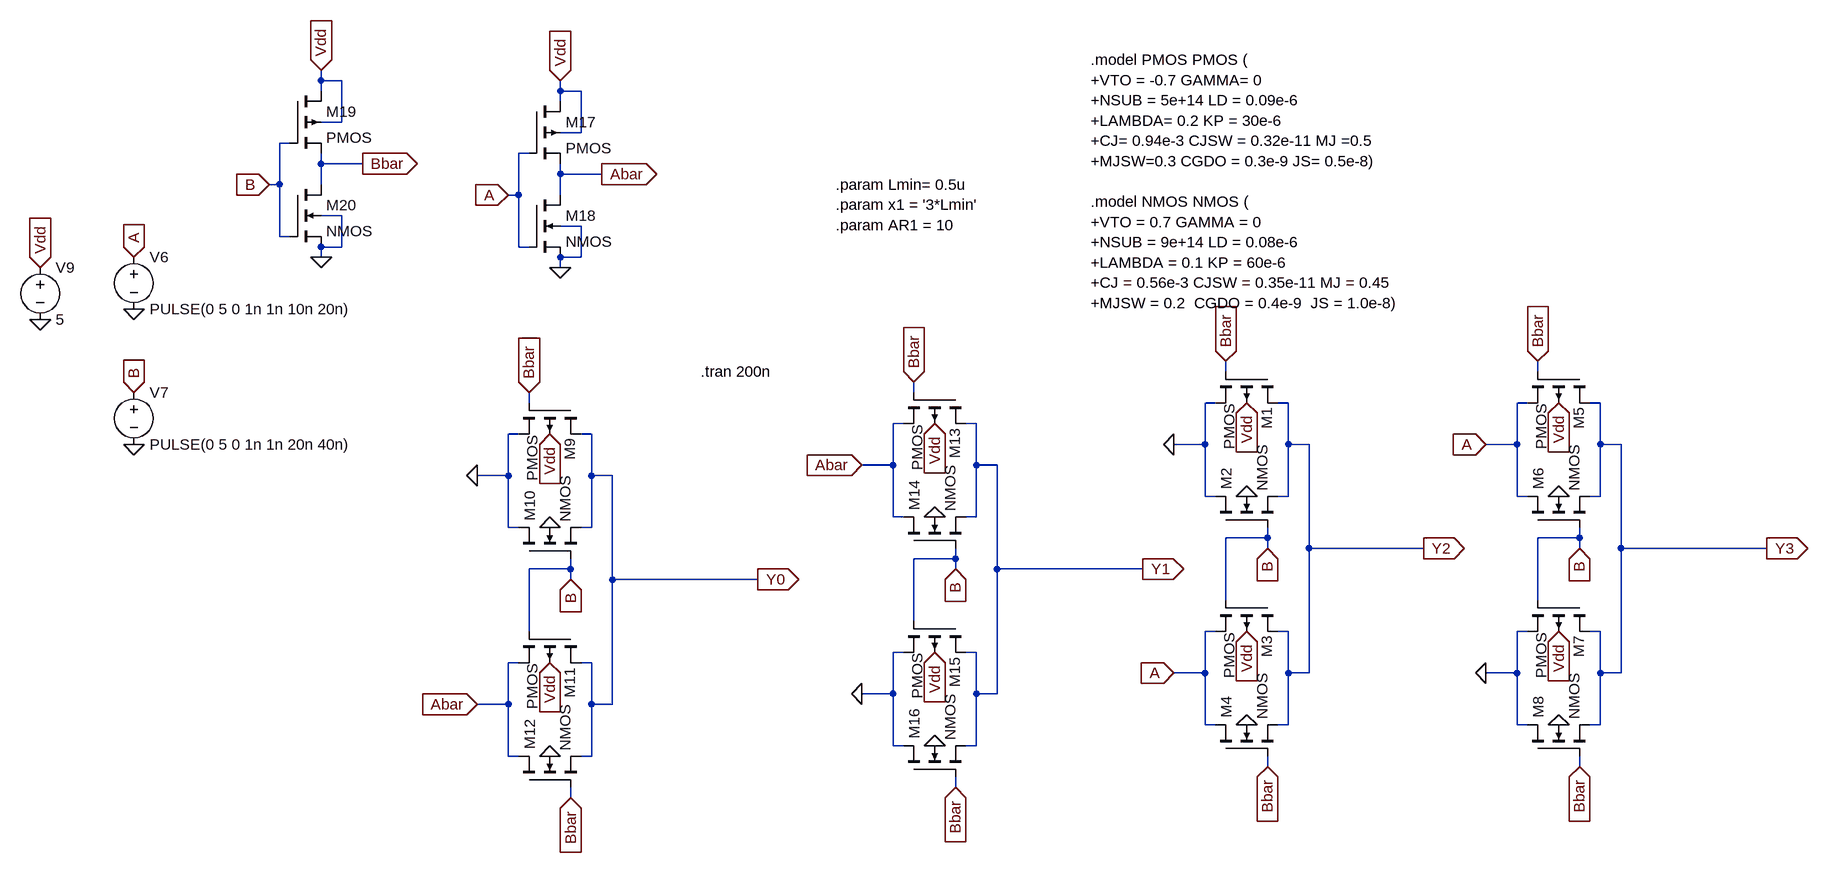
[diagram p0: schematic Txn gate 2x4 decoder.asc]
Txn gate 2x4 decoder.asc, the LTspice schematic file:
Version 4
SHEET 1 1412 1060
WIRE -1472 -160 -1472 -176
WIRE -1440 -160 -1472 -160
WIRE -1472 -144 -1472 -160
WIRE -1104 -144 -1104 -160
WIRE -1072 -144 -1104 -144
WIRE -1104 -128 -1104 -144
WIRE -1440 -96 -1440 -160
WIRE -1440 -96 -1472 -96
WIRE -1072 -80 -1072 -144
WIRE -1072 -80 -1104 -80
WIRE -1520 -64 -1536 -64
WIRE -1152 -48 -1168 -48
WIRE -1472 -32 -1472 -48
WIRE -1408 -32 -1472 -32
WIRE -1104 -16 -1104 -32
WIRE -1040 -16 -1104 -16
WIRE -1536 0 -1536 -64
WIRE -1536 0 -1552 0
WIRE -1472 0 -1472 -32
WIRE -1168 16 -1168 -48
WIRE -1168 16 -1184 16
WIRE -1104 16 -1104 -16
WIRE -1440 48 -1472 48
WIRE -1072 64 -1104 64
WIRE -1536 80 -1536 0
WIRE -1520 80 -1536 80
WIRE -1440 96 -1440 48
WIRE -1440 96 -1472 96
WIRE -1168 96 -1168 16
WIRE -1152 96 -1168 96
WIRE -1472 112 -1472 96
WIRE -1072 112 -1072 64
WIRE -1072 112 -1104 112
WIRE -1104 128 -1104 112
WIRE -80 288 -80 272
WIRE 400 288 400 272
WIRE -560 320 -560 304
WIRE -1152 336 -1152 320
WIRE -96 336 -112 336
WIRE 16 336 0 336
WIRE 384 336 368 336
WIRE 496 336 480 336
WIRE -576 368 -592 368
WIRE -464 368 -480 368
WIRE -1168 384 -1184 384
WIRE -1056 384 -1072 384
WIRE -112 400 -112 336
WIRE -112 400 -160 400
WIRE 16 400 16 336
WIRE 48 400 16 400
WIRE 368 400 368 336
WIRE 368 400 320 400
WIRE 496 400 496 336
WIRE 528 400 496 400
WIRE -592 432 -592 368
WIRE -592 432 -640 432
WIRE -464 432 -464 368
WIRE -432 432 -464 432
WIRE -1184 448 -1184 384
WIRE -1184 448 -1232 448
WIRE -1056 448 -1056 384
WIRE -1024 448 -1056 448
WIRE -112 480 -112 400
WIRE -96 480 -112 480
WIRE 16 480 16 400
WIRE 16 480 0 480
WIRE 368 480 368 400
WIRE 384 480 368 480
WIRE 496 480 496 400
WIRE 496 480 480 480
WIRE -592 512 -592 432
WIRE -576 512 -592 512
WIRE -464 512 -464 432
WIRE -464 512 -480 512
WIRE -1184 528 -1184 448
WIRE -1168 528 -1184 528
WIRE -1056 528 -1056 448
WIRE -1056 528 -1072 528
WIRE -16 544 -16 528
WIRE -16 544 -80 544
WIRE 464 544 464 528
WIRE 464 544 400 544
WIRE -16 560 -16 544
WIRE 48 560 48 400
WIRE 224 560 48 560
WIRE 464 560 464 544
WIRE 528 560 528 400
WIRE 752 560 528 560
WIRE -496 576 -496 560
WIRE -496 576 -560 576
WIRE -1088 592 -1088 576
WIRE -1088 592 -1152 592
WIRE -496 592 -496 576
WIRE -432 592 -432 432
WIRE -208 592 -432 592
WIRE -1088 608 -1088 592
WIRE -1024 608 -1024 448
WIRE -800 608 -1024 608
WIRE -80 640 -80 544
WIRE 400 640 400 544
WIRE -560 672 -560 576
WIRE -1152 688 -1152 592
WIRE -96 688 -112 688
WIRE 16 688 0 688
WIRE 384 688 368 688
WIRE 496 688 480 688
WIRE -576 720 -592 720
WIRE -464 720 -480 720
WIRE -1168 736 -1184 736
WIRE -1056 736 -1072 736
WIRE -112 752 -112 688
WIRE -112 752 -160 752
WIRE 16 752 16 688
WIRE 48 752 48 560
WIRE 48 752 16 752
WIRE 368 752 368 688
WIRE 368 752 320 752
WIRE 496 752 496 688
WIRE 528 752 528 560
WIRE 528 752 496 752
WIRE -592 784 -592 720
WIRE -592 784 -640 784
WIRE -464 784 -464 720
WIRE -432 784 -432 592
WIRE -432 784 -464 784
WIRE -1184 800 -1184 736
WIRE -1184 800 -1232 800
WIRE -1056 800 -1056 736
WIRE -1024 800 -1024 608
WIRE -1024 800 -1056 800
WIRE -112 832 -112 752
WIRE -96 832 -112 832
WIRE 16 832 16 752
WIRE 16 832 0 832
WIRE 368 832 368 752
WIRE 384 832 368 832
WIRE 496 832 496 752
WIRE 496 832 480 832
WIRE -592 864 -592 784
WIRE -576 864 -592 864
WIRE -464 864 -464 784
WIRE -464 864 -480 864
WIRE -1184 880 -1184 800
WIRE -1168 880 -1184 880
WIRE -1056 880 -1056 800
WIRE -1056 880 -1072 880
WIRE -16 896 -16 880
WIRE 464 896 464 880
WIRE -496 928 -496 912
WIRE -1088 944 -1088 928
FLAG -48 480 0
FLAG -48 336 Vdd
IOPIN -48 336 In
FLAG 224 560 Y2
IOPIN 224 560 Out
FLAG -16 560 B
IOPIN -16 560 In
FLAG -80 272 Bbar
IOPIN -80 272 In
FLAG -48 832 0
FLAG -48 688 Vdd
IOPIN -48 688 In
FLAG -16 896 Bbar
IOPIN -16 896 In
FLAG 432 480 0
FLAG 432 336 Vdd
IOPIN 432 336 In
FLAG 320 400 A
IOPIN 320 400 In
FLAG 752 560 Y3
IOPIN 752 560 Out
FLAG 464 560 B
IOPIN 464 560 In
FLAG 400 272 Bbar
IOPIN 400 272 In
FLAG 432 832 0
FLAG 432 688 Vdd
IOPIN 432 688 In
FLAG 464 896 Bbar
IOPIN 464 896 In
FLAG 320 752 0
FLAG -1120 528 0
FLAG -1120 384 Vdd
IOPIN -1120 384 In
FLAG -800 608 Y0
IOPIN -800 608 Out
FLAG -1088 608 B
IOPIN -1088 608 In
FLAG -1152 320 Bbar
IOPIN -1152 320 In
FLAG -1120 880 0
FLAG -1120 736 Vdd
IOPIN -1120 736 In
FLAG -1088 944 Bbar
IOPIN -1088 944 In
FLAG -528 512 0
FLAG -528 368 Vdd
IOPIN -528 368 In
FLAG -640 432 Abar
IOPIN -640 432 In
FLAG -208 592 Y1
IOPIN -208 592 Out
FLAG -496 592 B
IOPIN -496 592 In
FLAG -560 304 Bbar
IOPIN -560 304 In
FLAG -528 864 0
FLAG -528 720 Vdd
IOPIN -528 720 In
FLAG -496 928 Bbar
IOPIN -496 928 In
FLAG -640 784 0
FLAG -160 400 0
FLAG -160 752 A
IOPIN -160 752 In
FLAG -1232 448 0
FLAG -1232 800 Abar
IOPIN -1232 800 In
FLAG -1760 320 B
IOPIN -1760 320 In
FLAG -1760 112 A
IOPIN -1760 112 In
FLAG -1760 192 0
FLAG -1760 400 0
FLAG -1904 128 Vdd
IOPIN -1904 128 In
FLAG -1904 208 0
FLAG -1472 112 0
FLAG -1552 0 B
IOPIN -1552 0 In
FLAG -1408 -32 Bbar
IOPIN -1408 -32 Out
FLAG -1472 -176 Vdd
IOPIN -1472 -176 In
FLAG -1104 128 0
FLAG -1184 16 A
IOPIN -1184 16 In
FLAG -1040 -16 Abar
IOPIN -1040 -16 Out
FLAG -1104 -160 Vdd
IOPIN -1104 -160 In
SYMBOL pmos4 0 288 R90
WINDOW 0 55 17 Left 2
WINDOW 3 50 75 Left 2
SYMATTR InstName M1
SYMATTR Value2 l={Lmin} w={AR1*Lmin} ad={x1*AR1*Lmin} as={x1*AR1*Lmin} pd={2*x1 + 2*AR1*Lmin} ps={2*x1 + 2*AR1*Lmin}
SYMBOL nmos4 -96 528 R270
WINDOW 0 58 17 Left 2
SYMATTR InstName M2
SYMATTR Value2 l={Lmin} w={AR1*Lmin} ad={x1*AR1*Lmin} as={x1*AR1*Lmin} pd={2*x1 + 2*AR1*Lmin} ps={2*x1 + 2*AR1*Lmin}
SYMBOL pmos4 0 640 R90
WINDOW 0 55 17 Left 2
WINDOW 3 50 75 Left 2
SYMATTR InstName M3
SYMATTR Value2 l={Lmin} w={AR1*Lmin} ad={x1*AR1*Lmin} as={x1*AR1*Lmin} pd={2*x1 + 2*AR1*Lmin} ps={2*x1 + 2*AR1*Lmin}
SYMBOL nmos4 -96 880 R270
WINDOW 0 58 17 Left 2
SYMATTR InstName M4
SYMATTR Value2 l={Lmin} w={AR1*Lmin} ad={x1*AR1*Lmin} as={x1*AR1*Lmin} pd={2*x1 + 2*AR1*Lmin} ps={2*x1 + 2*AR1*Lmin}
SYMBOL pmos4 480 288 R90
WINDOW 0 55 17 Left 2
WINDOW 3 50 75 Left 2
SYMATTR InstName M5
SYMATTR Value2 l={Lmin} w={AR1*Lmin} ad={x1*AR1*Lmin} as={x1*AR1*Lmin} pd={2*x1 + 2*AR1*Lmin} ps={2*x1 + 2*AR1*Lmin}
SYMBOL nmos4 384 528 R270
WINDOW 0 58 17 Left 2
SYMATTR InstName M6
SYMATTR Value2 l={Lmin} w={AR1*Lmin} ad={x1*AR1*Lmin} as={x1*AR1*Lmin} pd={2*x1 + 2*AR1*Lmin} ps={2*x1 + 2*AR1*Lmin}
SYMBOL pmos4 480 640 R90
WINDOW 0 55 17 Left 2
WINDOW 3 50 75 Left 2
SYMATTR InstName M7
SYMATTR Value2 l={Lmin} w={AR1*Lmin} ad={x1*AR1*Lmin} as={x1*AR1*Lmin} pd={2*x1 + 2*AR1*Lmin} ps={2*x1 + 2*AR1*Lmin}
SYMBOL nmos4 384 880 R270
WINDOW 0 58 17 Left 2
SYMATTR InstName M8
SYMATTR Value2 l={Lmin} w={AR1*Lmin} ad={x1*AR1*Lmin} as={x1*AR1*Lmin} pd={2*x1 + 2*AR1*Lmin} ps={2*x1 + 2*AR1*Lmin}
SYMBOL pmos4 -1072 336 R90
WINDOW 0 55 17 Left 2
WINDOW 3 50 75 Left 2
SYMATTR InstName M9
SYMATTR Value2 l={Lmin} w={AR1*Lmin} ad={x1*AR1*Lmin} as={x1*AR1*Lmin} pd={2*x1 + 2*AR1*Lmin} ps={2*x1 + 2*AR1*Lmin}
SYMBOL nmos4 -1168 576 R270
WINDOW 0 58 17 Left 2
SYMATTR InstName M10
SYMATTR Value2 l={Lmin} w={AR1*Lmin} ad={x1*AR1*Lmin} as={x1*AR1*Lmin} pd={2*x1 + 2*AR1*Lmin} ps={2*x1 + 2*AR1*Lmin}
SYMBOL pmos4 -1072 688 R90
WINDOW 0 55 17 Left 2
WINDOW 3 50 75 Left 2
SYMATTR InstName M11
SYMATTR Value2 l={Lmin} w={AR1*Lmin} ad={x1*AR1*Lmin} as={x1*AR1*Lmin} pd={2*x1 + 2*AR1*Lmin} ps={2*x1 + 2*AR1*Lmin}
SYMBOL nmos4 -1168 928 R270
WINDOW 0 58 17 Left 2
SYMATTR InstName M12
SYMATTR Value2 l={Lmin} w={AR1*Lmin} ad={x1*AR1*Lmin} as={x1*AR1*Lmin} pd={2*x1 + 2*AR1*Lmin} ps={2*x1 + 2*AR1*Lmin}
SYMBOL pmos4 -480 320 R90
WINDOW 0 55 17 Left 2
WINDOW 3 50 75 Left 2
SYMATTR InstName M13
SYMATTR Value2 l={Lmin} w={AR1*Lmin} ad={x1*AR1*Lmin} as={x1*AR1*Lmin} pd={2*x1 + 2*AR1*Lmin} ps={2*x1 + 2*AR1*Lmin}
SYMBOL nmos4 -576 560 R270
WINDOW 0 58 17 Left 2
SYMATTR InstName M14
SYMATTR Value2 l={Lmin} w={AR1*Lmin} ad={x1*AR1*Lmin} as={x1*AR1*Lmin} pd={2*x1 + 2*AR1*Lmin} ps={2*x1 + 2*AR1*Lmin}
SYMBOL pmos4 -480 672 R90
WINDOW 0 55 17 Left 2
WINDOW 3 50 75 Left 2
SYMATTR InstName M15
SYMATTR Value2 l={Lmin} w={AR1*Lmin} ad={x1*AR1*Lmin} as={x1*AR1*Lmin} pd={2*x1 + 2*AR1*Lmin} ps={2*x1 + 2*AR1*Lmin}
SYMBOL nmos4 -576 912 R270
WINDOW 0 58 17 Left 2
SYMATTR InstName M16
SYMATTR Value2 l={Lmin} w={AR1*Lmin} ad={x1*AR1*Lmin} as={x1*AR1*Lmin} pd={2*x1 + 2*AR1*Lmin} ps={2*x1 + 2*AR1*Lmin}
SYMBOL voltage -1760 96 R0
WINDOW 123 0 0 Left 0
WINDOW 39 0 0 Left 0
SYMATTR InstName V6
SYMATTR Value PULSE(0 5 0 1n 1n 10n 20n)
SYMBOL voltage -1760 304 R0
WINDOW 123 0 0 Left 0
WINDOW 39 0 0 Left 0
SYMATTR InstName V7
SYMATTR Value PULSE(0 5 0 1n 1n 20n 40n)
SYMBOL voltage -1904 112 R0
WINDOW 123 0 0 Left 0
WINDOW 39 0 0 Left 0
SYMATTR InstName V9
SYMATTR Value 5
SYMBOL pmos4 -1520 -144 R0
SYMATTR InstName M19
SYMATTR Value2 l={Lmin} w={AR1*Lmin} ad={x1*AR1*Lmin} as={x1*AR1*Lmin} pd={2*x1 + 2*AR1*Lmin} ps={2*x1 + 2*AR1*Lmin}
SYMBOL nmos4 -1520 0 R0
SYMATTR InstName M20
SYMATTR Value2 l={Lmin} w={AR1*Lmin} ad={x1*AR1*Lmin} as={x1*AR1*Lmin} pd={2*x1 + 2*AR1*Lmin} ps={2*x1 + 2*AR1*Lmin}
SYMBOL pmos4 -1152 -128 R0
SYMATTR InstName M17
SYMATTR Value2 l={Lmin} w={AR1*Lmin} ad={x1*AR1*Lmin} as={x1*AR1*Lmin} pd={2*x1 + 2*AR1*Lmin} ps={2*x1 + 2*AR1*Lmin}
SYMBOL nmos4 -1152 16 R0
SYMATTR InstName M18
SYMATTR Value2 l={Lmin} w={AR1*Lmin} ad={x1*AR1*Lmin} as={x1*AR1*Lmin} pd={2*x1 + 2*AR1*Lmin} ps={2*x1 + 2*AR1*Lmin}
TEXT -888 288 Left 2 !.tran 200n
TEXT -680 0 Left 2 !.param Lmin= 0.5u\n.param x1 = '3*Lmin'\n.param AR1 = 10
TEXT -288 -192 Left 2 !.model PMOS PMOS (\n+VTO = -0.7 GAMMA= 0 \n+NSUB = 5e+14 LD = 0.09e-6 \n+LAMBDA= 0.2 KP = 30e-6\n+CJ= 0.94e-3 CJSW = 0.32e-11 MJ =0.5 \n+MJSW=0.3 CGDO = 0.3e-9 JS= 0.5e-8)\n \n.model NMOS NMOS ( \n+VTO = 0.7 GAMMA = 0 \n+NSUB = 9e+14 LD = 0.08e-6 \n+LAMBDA = 0.1 KP = 60e-6 \n+CJ = 0.56e-3 CJSW = 0.35e-11 MJ = 0.45 \n+MJSW = 0.2  CGDO = 0.4e-9  JS = 1.0e-8)

The netlist it stands for:
* Txn gate 2x4 decoder.asc
M1 Y2 Bbar 0 Vdd PMOS l={Lmin} w={AR1*Lmin} ad={x1*AR1*Lmin} as={x1*AR1*Lmin} pd={2*x1 + 2*AR1*Lmin} ps={2*x1 + 2*AR1*Lmin}
M2 0 B Y2 0 NMOS l={Lmin} w={AR1*Lmin} ad={x1*AR1*Lmin} as={x1*AR1*Lmin} pd={2*x1 + 2*AR1*Lmin} ps={2*x1 + 2*AR1*Lmin}
M3 Y2 B A Vdd PMOS l={Lmin} w={AR1*Lmin} ad={x1*AR1*Lmin} as={x1*AR1*Lmin} pd={2*x1 + 2*AR1*Lmin} ps={2*x1 + 2*AR1*Lmin}
M4 A Bbar Y2 0 NMOS l={Lmin} w={AR1*Lmin} ad={x1*AR1*Lmin} as={x1*AR1*Lmin} pd={2*x1 + 2*AR1*Lmin} ps={2*x1 + 2*AR1*Lmin}
M5 Y3 Bbar A Vdd PMOS l={Lmin} w={AR1*Lmin} ad={x1*AR1*Lmin} as={x1*AR1*Lmin} pd={2*x1 + 2*AR1*Lmin} ps={2*x1 + 2*AR1*Lmin}
M6 A B Y3 0 NMOS l={Lmin} w={AR1*Lmin} ad={x1*AR1*Lmin} as={x1*AR1*Lmin} pd={2*x1 + 2*AR1*Lmin} ps={2*x1 + 2*AR1*Lmin}
M7 Y3 B 0 Vdd PMOS l={Lmin} w={AR1*Lmin} ad={x1*AR1*Lmin} as={x1*AR1*Lmin} pd={2*x1 + 2*AR1*Lmin} ps={2*x1 + 2*AR1*Lmin}
M8 0 Bbar Y3 0 NMOS l={Lmin} w={AR1*Lmin} ad={x1*AR1*Lmin} as={x1*AR1*Lmin} pd={2*x1 + 2*AR1*Lmin} ps={2*x1 + 2*AR1*Lmin}
M9 Y0 Bbar 0 Vdd PMOS l={Lmin} w={AR1*Lmin} ad={x1*AR1*Lmin} as={x1*AR1*Lmin} pd={2*x1 + 2*AR1*Lmin} ps={2*x1 + 2*AR1*Lmin}
M10 0 B Y0 0 NMOS l={Lmin} w={AR1*Lmin} ad={x1*AR1*Lmin} as={x1*AR1*Lmin} pd={2*x1 + 2*AR1*Lmin} ps={2*x1 + 2*AR1*Lmin}
M11 Y0 B Abar Vdd PMOS l={Lmin} w={AR1*Lmin} ad={x1*AR1*Lmin} as={x1*AR1*Lmin} pd={2*x1 + 2*AR1*Lmin} ps={2*x1 + 2*AR1*Lmin}
M12 Abar Bbar Y0 0 NMOS l={Lmin} w={AR1*Lmin} ad={x1*AR1*Lmin} as={x1*AR1*Lmin} pd={2*x1 + 2*AR1*Lmin} ps={2*x1 + 2*AR1*Lmin}
M13 Y1 Bbar Abar Vdd PMOS l={Lmin} w={AR1*Lmin} ad={x1*AR1*Lmin} as={x1*AR1*Lmin} pd={2*x1 + 2*AR1*Lmin} ps={2*x1 + 2*AR1*Lmin}
M14 Abar B Y1 0 NMOS l={Lmin} w={AR1*Lmin} ad={x1*AR1*Lmin} as={x1*AR1*Lmin} pd={2*x1 + 2*AR1*Lmin} ps={2*x1 + 2*AR1*Lmin}
M15 Y1 B 0 Vdd PMOS l={Lmin} w={AR1*Lmin} ad={x1*AR1*Lmin} as={x1*AR1*Lmin} pd={2*x1 + 2*AR1*Lmin} ps={2*x1 + 2*AR1*Lmin}
M16 0 Bbar Y1 0 NMOS l={Lmin} w={AR1*Lmin} ad={x1*AR1*Lmin} as={x1*AR1*Lmin} pd={2*x1 + 2*AR1*Lmin} ps={2*x1 + 2*AR1*Lmin}
V6 A 0 PULSE(0 5 0 1n 1n 10n 20n)
V7 B 0 PULSE(0 5 0 1n 1n 20n 40n)
V9 Vdd 0 5
M19 Vdd B Bbar Vdd PMOS l={Lmin} w={AR1*Lmin} ad={x1*AR1*Lmin} as={x1*AR1*Lmin} pd={2*x1 + 2*AR1*Lmin} ps={2*x1 + 2*AR1*Lmin}
M20 Bbar B 0 0 NMOS l={Lmin} w={AR1*Lmin} ad={x1*AR1*Lmin} as={x1*AR1*Lmin} pd={2*x1 + 2*AR1*Lmin} ps={2*x1 + 2*AR1*Lmin}
M17 Vdd A Abar Vdd PMOS l={Lmin} w={AR1*Lmin} ad={x1*AR1*Lmin} as={x1*AR1*Lmin} pd={2*x1 + 2*AR1*Lmin} ps={2*x1 + 2*AR1*Lmin}
M18 Abar A 0 0 NMOS l={Lmin} w={AR1*Lmin} ad={x1*AR1*Lmin} as={x1*AR1*Lmin} pd={2*x1 + 2*AR1*Lmin} ps={2*x1 + 2*AR1*Lmin}
.model NMOS NMOS
.model PMOS PMOS
.lib standard.mos
.tran 200n
.param Lmin= 0.5u
.param x1 = '3*Lmin'
.param AR1 = 10
.model PMOS PMOS (
+VTO = -0.7 GAMMA= 0
+NSUB = 5e+14 LD = 0.09e-6
+LAMBDA= 0.2 KP = 30e-6
+CJ= 0.94e-3 CJSW = 0.32e-11 MJ =0.5
+MJSW=0.3 CGDO = 0.3e-9 JS= 0.5e-8)
.model NMOS NMOS (
+VTO = 0.7 GAMMA = 0
+NSUB = 9e+14 LD = 0.08e-6
+LAMBDA = 0.1 KP = 60e-6
+CJ = 0.56e-3 CJSW = 0.35e-11 MJ = 0.45
+MJSW = 0.2  CGDO = 0.4e-9  JS = 1.0e-8)
.backanno
.end